# Altium schematic sheet DRV2700.SchDoc
size A4
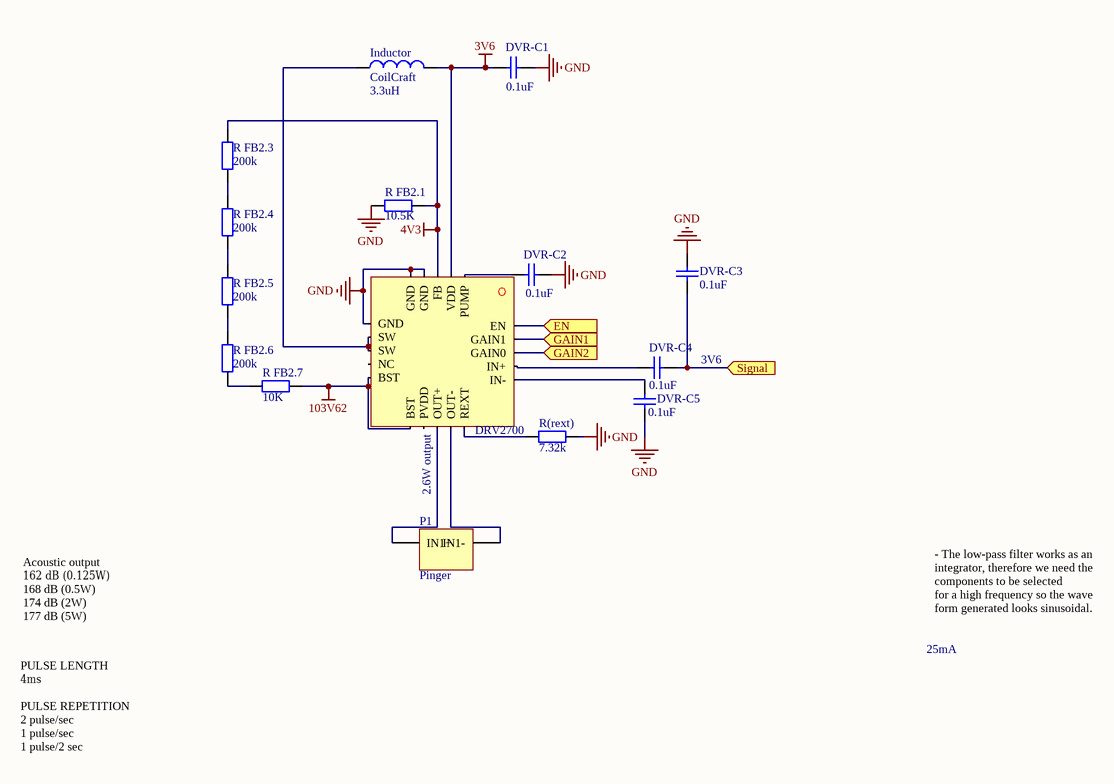
[diagram p0: DRV2700.SchDoc]

## Parts
DRV  DRV2700  [QFN50P400X400X100_HS-21N]
DVR-C1  value 0.1uF  [CAPC1608N(0603")]  (hidden comment: +10V rating and X5R or X7R)
DVR-C2  value 0.1uF  [CAPC1608N(0603")]  (hidden comment: +10V rating and X5R or X7R)
DVR-C3  value 0.1uF  [CAPC1608N(0603")]  (hidden comment: Cap)
DVR-C4  value 0.1uF  [CAPC1608N(0603")]  (hidden comment: Cap)
DVR-C5  value 0.1uF  [CAPC1608N(0603")]  (hidden comment: Cap)
Inductor  CoilCraft  value 3.3uH  [INDP2828X23N]
P1  Pinger  [*JST_XHP-2]
R(rext)  value 7.32k  [RESC1608N(0603")]  (hidden comment: Res2)
R_FB2.1  value 10.5K  [RESC1608N(0603")]  (hidden comment: Res2)
R_FB2.3  value 200k  [RESC1608N(0603")]  (hidden comment: Res2)
R_FB2.4  value 200k  [RESC1608N(0603")]  (hidden comment: Res2)
R_FB2.5  value 200k  [RESC1608N(0603")]  (hidden comment: Res2)
R_FB2.6  value 200k  [RESC1608N(0603")]  (hidden comment: Res2)
R_FB2.7  value 10K  [RESC1608N(0603")]  (hidden comment: Res2)

## Ports
EN (in), GAIN1 (in), GAIN2 (in), Signal (in)

## Nets
3V6: DRV.2(VDD) DVR-C1.2 Inductor.2
4V3: DRV.3(FB) R_FB2.1.2 R_FB2.3.1
103V62: DRV.10(BST) DRV.11(BST) R_FB2.7.2
GND: DRV.4(GND) DRV.5(GND) DRV.6(GND) DVR-C1.1 DVR-C2.1 DVR-C3.1 DVR-C5.1 R(rext).1 R_FB2.1.1
EN: DRV.20(EN) ; port EN
GAIN1: DRV.19(GAIN1) ; port GAIN1
GAIN2: DRV.18(GAIN0) ; port GAIN2
Signal: DVR-C3.2 DVR-C4.1 ; port Signal
NetDRV_1: DRV.1(PUMP) DVR-C2.2
NetDRV_7: DRV.7(SW) DRV.8(SW) Inductor.1
NetDRV_13: DRV.13(OUT+) P1.1(IN1+)
NetDRV_14: DRV.14(OUT-) P1.2(IN1-)
NetDRV_15: DRV.15(REXT) R(rext).2
NetDRV_16: DRV.16(IN-) DVR-C5.2
NetDRV_17: DRV.17(IN+) DVR-C4.2
NetR_FB2.3_2: R_FB2.3.2 R_FB2.4.1
NetR_FB2.4_2: R_FB2.4.2 R_FB2.5.1
NetR_FB2.5_2: R_FB2.5.2 R_FB2.6.1
NetR_FB2.6_2: R_FB2.6.2 R_FB2.7.1

Not connected (* = marked no-connect by the designer): DRV 9(NC) 12(PVDD)

## Notes on the sheet
- (near DVR-C4) 3V6
- (near DRV) 2.6W output
- Acoustic output
  ​162 dB (0.125W)
  168 dB (0.5W)
  174 dB (2W)
  177 dB (5W)
- 25mA
- - The low-pass filter works as an integrator, therefore we need the components to be selected
  for a high frequency so the wave form generated looks sinusoidal.
- PULSE LENGTH
  ​4ms
  PULSE REPETITION
  2 pulse/sec
  1 pulse/sec
  1 pulse/2 sec

## Library data of the parts
DVR-C1-DVR-C3 = Cap: Capacitor; Published: 8-Jun-2000; LatestRevisionDate: 17-Jul-2002; LatestRevisionNote: Re-released for DXP Platform.; PackageReference: RAD-0.3; Publisher: Altium Limited; PackageDescription: Radial Cap, Thru-Hole; 2 Leads; 0.3 in Pin Spacing
DVR-C4 = Cap: must have 105V rating; Published: 8-Jun-2000; LatestRevisionDate: 17-Jul-2002; LatestRevisionNote: Re-released for DXP Platform.; PackageReference: RAD-0.3; Publisher: Altium Limited; PackageDescription: Radial Cap, Thru-Hole; 2 Leads; 0.3 in Pin Spacing
DVR-C5 = Cap: must have a 105V rating; Published: 8-Jun-2000; LatestRevisionDate: 17-Jul-2002; LatestRevisionNote: Re-released for DXP Platform.; PackageReference: RAD-0.3; Publisher: Altium Limited; PackageDescription: Radial Cap, Thru-Hole; 2 Leads; 0.3 in Pin Spacing
Inductor = Inductor: LPS4018-332MLB; Code_IEC: 1005; Published: 8-Jun-2000; LatestRevisionDate: 29-May-2009; LatestRevisionNote: IPC-7351 Footprint Added.; PackageReference: 0402-A; Publisher: Altium Limited; PackageDescription: Chip Inductor; Code_JEITA: 0402
P1 = Header 2X2: Header, 2-Pin, Dual row; LatestRevisionDate: 17-Jul-2002; LatestRevisionNote: Re-released for DXP Platform.; Publisher: Altium Limited
R(rext) = Res2: Current-Limiting Control Resistor; Published: 8-Jun-2000; LatestRevisionDate: 17-Jul-2002; LatestRevisionNote: Re-released for DXP Platform.; PackageReference: AXIAL-0.4; Publisher: Altium Limited; PackageDescription: Axial Device, Thru-Hole; 2 Leads; 0.4 in Pin Spacing
R_FB2.1 R_FB2.3-R_FB2.7 = Res2: Resistor; Published: 8-Jun-2000; LatestRevisionDate: 17-Jul-2002; LatestRevisionNote: Re-released for DXP Platform.; PackageReference: AXIAL-0.4; Publisher: Altium Limited; PackageDescription: Axial Device, Thru-Hole; 2 Leads; 0.4 in Pin Spacing
  R_FB2.3-R_FB2.7: Digikey: RC0201FR-07200KL
DRV = DRV2700: Supplier 1: Mouser; Supplier Part Number 1: 595-DRV2700RGPT